# Altium project PCB_Project.PrjPcb
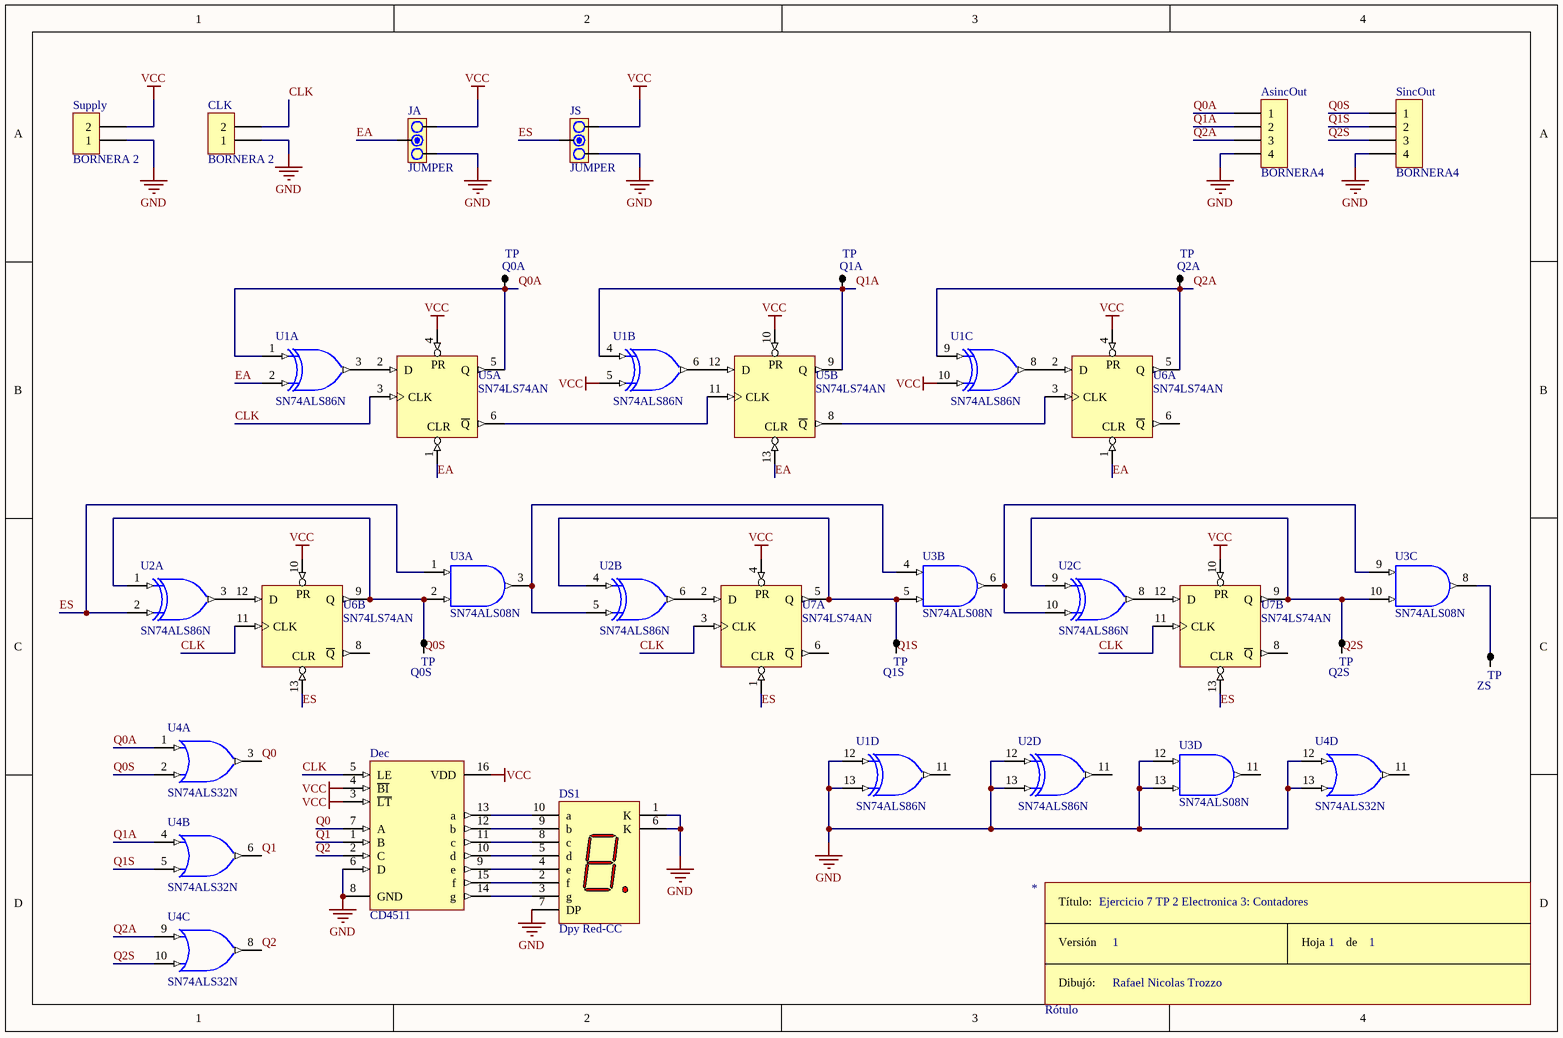
[diagram p0: counter.SchDoc]
1 sheet, 23 parts. Net scope: global (net labels, ports and power ports of the same name join across sheets).
Board file: counter.PcbDoc

## Sheet counter.SchDoc
size A4

### Parts
*  Rótulo
AsincOut  BORNERA4  [BORNERA4]
CLK  BORNERA 2  [BORNERA2]
Dec  CD4511  [DIP16]
DS1  Dpy Red-CC  [A]
JA  JUMPER  [JUMPER3]
JS  JUMPER  [JUMPER3]
Q0A  TP  [TPTH]
Q0S  TP  [TPTH]
Q1A  TP  [TPTH]
Q1S  TP  [TPTH]
Q2A  TP  [TPTH]
Q2S  TP  [TPTH]
SincOut  BORNERA4  [BORNERA4]
Supply  BORNERA 2  [BORNERA2]
U1  SN74ALS86N  [N014]  (parts A,B,C,D of 4)
U2  SN74ALS86N  [N014]  (parts A,B,C,D of 4)
U3  SN74ALS08N  [N014]  (parts A,B,C,D of 4)
U4  SN74ALS32N  [N014]  (parts A,B,C,D of 4)
U5  SN74LS74AN  [N014D]  (parts A,B of 2)
U6  SN74LS74AN  [N014D]  (parts A,B of 2)
U7  SN74LS74AN  [N014D]  (parts A,B of 2)
ZS  TP  [TPTH]

### Nets
GND: AsincOut.4 CLK.1 Dec.6(D) Dec.8(GND) DS1.1(K) DS1.6(K) DS1.7(DP) JA.3 JS.3 SincOut.4 Supply.1 U1.7(GND) U1.12(A) U1.13(B) U2.7(GND) U2.12(A) U2.13(B) U3.7(GND) U3.12(A) U3.13(B) U4.7(GND) U4.12(A) U4.13(B) U5.7(GND) U6.7(GND) U7.7(GND)
VCC: Dec.3(~{LT}) Dec.4(~{BI}) Dec.16(VDD) JA.1 JS.1 Supply.2 U1.5(B) U1.10(B) U1.14(VCC) U2.14(VCC) U3.14(VCC) U4.14(VCC) U5.4(PR) U5.10(PR) U5.14(VCC) U6.4(PR) U6.10(PR) U6.14(VCC) U7.4(PR) U7.10(PR) U7.14(VCC)
CLK: CLK.2 Dec.5(LE) U5.3(CLK) U6.11(CLK) U7.3(CLK) U7.11(CLK)
EA: JA.2 U1.2(B) U5.1(CLR) U5.13(CLR) U6.1(CLR)
ES: JS.2 U2.2(B) U3.1(A) U6.13(CLR) U7.1(CLR) U7.13(CLR)
Q0: Dec.7(A) U4.3(Y)
Q0A: AsincOut.1 Q0A.1 U1.1(A) U4.1(A) U5.5(Q)
Q0S: Q0S.1 SincOut.1 U2.1(A) U3.2(B) U4.2(B) U6.9(Q)
Q1: Dec.1(B) U4.6(Y)
Q1A: AsincOut.2 Q1A.1 U1.4(A) U4.4(A) U5.9(Q)
Q1S: Q1S.1 SincOut.2 U2.4(A) U3.5(B) U4.5(B) U7.5(Q)
Q2: Dec.2(C) U4.8(Y)
Q2A: AsincOut.3 Q2A.1 U1.9(A) U4.9(A) U6.5(Q)
Q2S: Q2S.1 SincOut.3 U2.9(A) U3.10(B) U4.10(B) U7.9(Q)
NetDec_9: Dec.9(e) DS1.4(e)
NetDec_10: Dec.10(d) DS1.5(d)
NetDec_11: Dec.11(c) DS1.8(c)
NetDec_12: Dec.12(b) DS1.9(b)
NetDec_13: Dec.13(a) DS1.10(a)
NetDec_14: Dec.14(g) DS1.3(g)
NetDec_15: Dec.15(f) DS1.2(f)
NetU1_3: U1.3(Y) U5.2(D)
NetU1_6: U1.6(Y) U5.12(D)
NetU1_8: U1.8(Y) U6.2(D)
NetU2_3: U2.3(Y) U6.12(D)
NetU2_5: U2.5(B) U3.3(Y) U3.4(A)
NetU2_6: U2.6(Y) U7.2(D)
NetU2_8: U2.8(Y) U7.12(D)
NetU2_10: U2.10(B) U3.6(Y) U3.9(A)
NetU3_8: U3.8(Y) ZS.1
NetU5_6: U5.6(~{Q}) U5.11(CLK)
NetU5_8: U5.8(~{Q}) U6.3(CLK)

Not connected (* = marked no-connect by the designer): U1 11(Y); U2 11(Y); U3 11(Y); U4 11(Y); U6 6(~{Q}) 8(~{Q}); U7 6(~{Q}) 8(~{Q})

### Notes on the sheet
- Ejercicio 7 TP 2 Electronica 3: Contadores
- 1
- Rafael Nicolas Trozzo
- (in symbol Rótulo) Título:; Versión; Hoja       de; Dibujó:

### Library data of the parts
AsincOut SincOut = BORNERA 4
Dec = CD4511: BCD to 7 SEGMENTOS
DS1 = Dpy Red-CC: 7.62 mm Black Surface HER 7-Segment Display: CC, RH DP; MinimumIntensity: 360 ucd; Note: IF = 5 mA; Colour: High Efficiency Red (HER); Note: Pins 1 and 6 are redundant Cathodes.; Published: 8-Jun-2000; LatestRevisionDate: 17-Dec-2003; LatestRevisionNote: Schematic revised, PCB Footprint replaced.; DatasheetVersion: 19-Feb-2002; PackageVersion: 11-Feb-2002; PackageReference: A; Publisher: Altium Limited; PackageDescription: LED, 7-Segment Display, 7.62 mm, RHD; 10 Leads; Row Space 5.08 mm; Pitch 2.54 mm; ComponentLink1Description: Manufacturer Link; ComponentLink1URL: http://www.agilent.com/
JA JS = JUMPER3
U1 U2 = SN74ALS86N: Quadruple 2-Input Exclusive-OR Gate; Published: 8-Jun-2000; LatestRevisionDate: 04-Mar-2005; LatestRevisionNote: Stylized 3D Model Added.; DatasheetVersion: Dec-1994; PackageVersion: Oct-1995; PackageReference: N014; Publisher: Altium Limited; PackageDescription: DIP; 14 Leads; Row Spacing 7.62 mm; Pitch 2.54 mm; ComponentLink1Description: Manufacturer Link; ComponentLink1URL: http://www.ti.com/; ComponentLink2Description: Datasheet; ComponentLink2URL: http://www-s.ti.com/sc/ds/sn54als86.pdf; ComponentLink3Description: Packaging Specification; ComponentLink3URL: http://focus.ti.com/lit/ml/mpdi002c/mpdi002c.pdf
U3 = SN74ALS08N: Quadruple 2-Input Positive-AND Gate; Published: 8-Jun-2000; LatestRevisionDate: 04-Mar-2005; LatestRevisionNote: Stylized 3D Model Added.; DatasheetVersion: Dec-1994; PackageVersion: Oct-1995; PackageReference: N014; Publisher: Altium Limited; PackageDescription: DIP; 14 Leads; Row Spacing 7.62 mm; Pitch 2.54 mm; ComponentLink1Description: Manufacturer Link; ComponentLink1URL: http://www.ti.com/; ComponentLink2Description: Datasheet; ComponentLink2URL: http://www-s.ti.com/sc/ds/sn74als08.pdf; ComponentLink3Description: Packaging Specification; ComponentLink3URL: http://focus.ti.com/lit/ml/mpdi002c/mpdi002c.pdf
U4 = SN74ALS32N: Quadruple 2-Input Positive-OR Gate; Published: 8-Jun-2000; LatestRevisionDate: 04-Mar-2005; LatestRevisionNote: Stylized 3D Model Added.; DatasheetVersion: Dec-1994; PackageVersion: Oct-1995; PackageReference: N014; Publisher: Altium Limited; PackageDescription: DIP; 14 Leads; Row Spacing 7.62 mm; Pitch 2.54 mm; ComponentLink1Description: Manufacturer Link; ComponentLink1URL: http://www.ti.com/; ComponentLink2Description: Datasheet; ComponentLink2URL: http://www-s.ti.com/sc/ds/sn74als32.pdf; ComponentLink3Description: Packaging Specification; ComponentLink3URL: http://focus.ti.com/lit/ml/mpdi002c/mpdi002c.pdf
U5-U7 = SN74LS74AN: Dual D-Type Positive-Edge-Triggered Flip-Flop with Preset and Clear; Published: 8-Jun-2000; LatestRevisionDate: 04-Mar-2005; LatestRevisionNote: Stylized 3D Model Added.; DatasheetVersion: Mar-1988; PackageVersion: Oct-1995; PackageReference: N014D; Publisher: Altium Limited; PackageDescription: DIP; 14 Leads; Row Spacing 7.62 mm; Pitch 2.54 mm; ComponentLink1Description: Manufacturer Link; ComponentLink1URL: http://www.ti.com/; ComponentLink2Description: Datasheet; ComponentLink2URL: http://www-s.ti.com/sc/ds/sn74ls74a.pdf